# Altium project STM32F4Trunk.PrjPcb
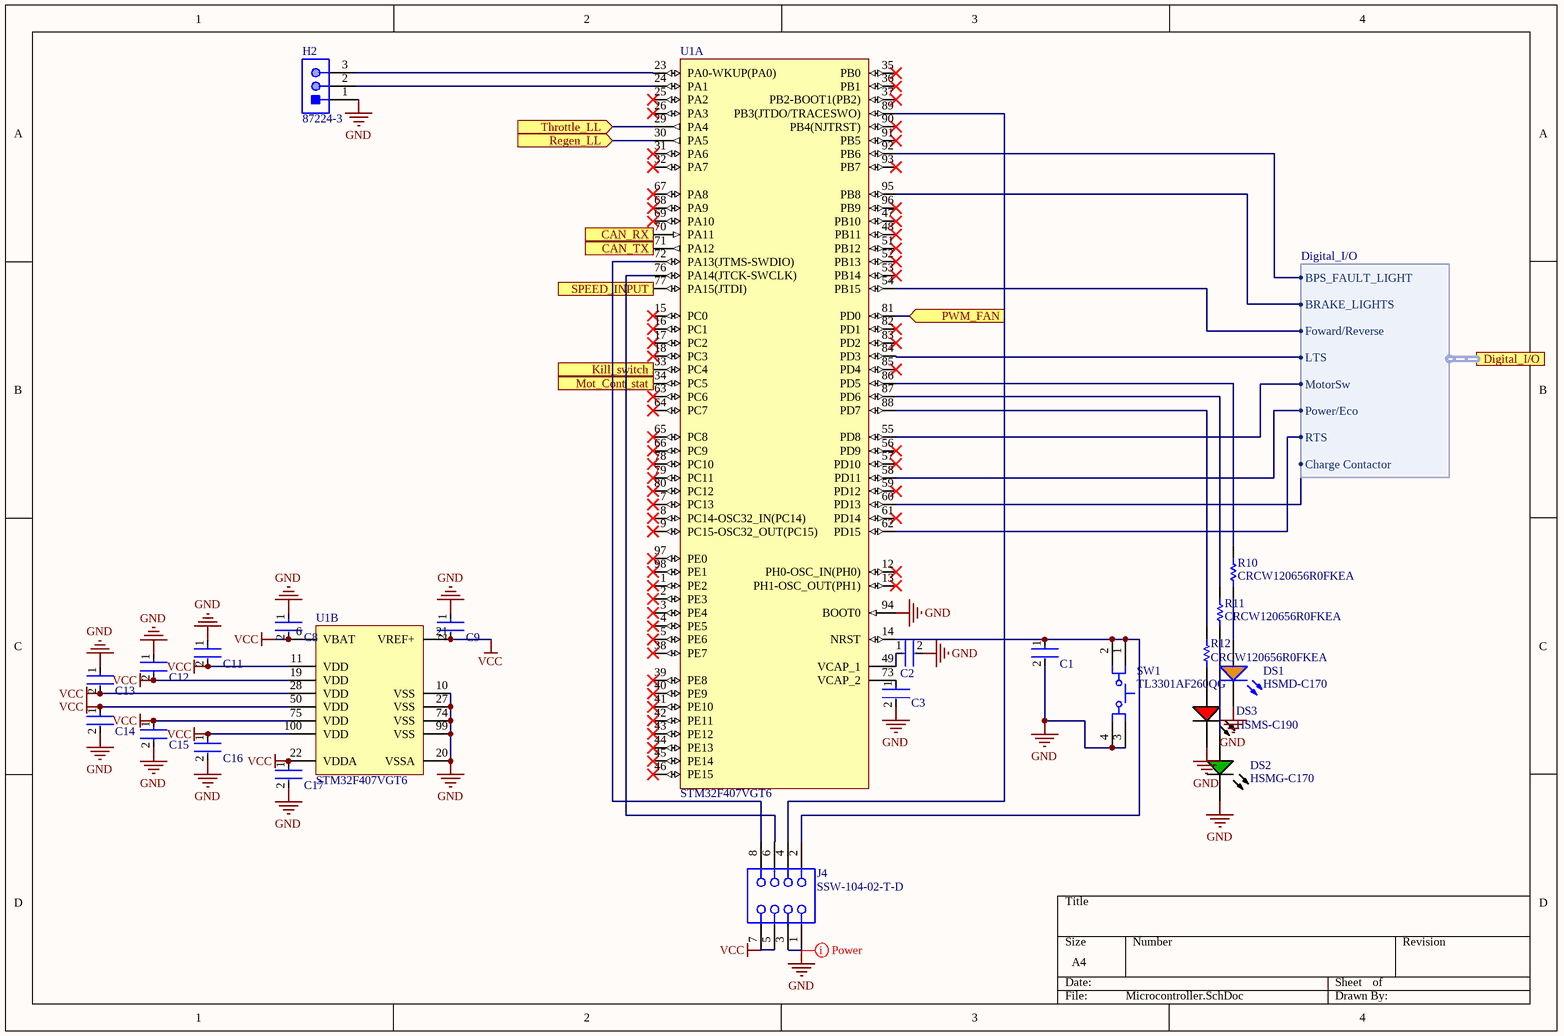
[diagram p0: Microcontroller.SchDoc]
5 sheets, 65 parts. Net scope: global (net labels, ports and power ports of the same name join across sheets).
Board file: PCB1.PcbDoc
Sheets:
  Microcontroller.SchDoc
  PowerSupply.SchDoc
  CAN.SchDoc
  ICs.SchDoc
  Connector.SchDoc

## Sheet Microcontroller.SchDoc
size A4

### Parts
C1  C0603C104K5RACTU  [Kemet_C0603_IPC_A]  (value not drawn)
C2  CC0805KKX7R6BB225  (value not drawn)
C3  CC0805KKX7R6BB225  (value not drawn)
C8  C0603C104K5RACTU  [Kemet_C0603_IPC_A]  (value not drawn)
C9  C0603C104K5RACTU  [Kemet_C0603_IPC_A]  (value not drawn)
C11  C0603C104K5RACTU  [Kemet_C0603_IPC_A]  (value not drawn)
C12  C0603C104K5RACTU  [Kemet_C0603_IPC_A]  (value not drawn)
C13  C0603C104K5RACTU  [Kemet_C0603_IPC_A]  (value not drawn)
C14  C0603C104K5RACTU  [Kemet_C0603_IPC_A]  (value not drawn)
C15  C0603C104K5RACTU  [Kemet_C0603_IPC_A]  (value not drawn)
C16  C0603C104K5RACTU  [Kemet_C0603_IPC_A]  (value not drawn)
C17  C0603C104K5RACTU  [Kemet_C0603_IPC_A]  (value not drawn)
DS1  HSMD-C170  [AVAG-HSMX-C170_V]
DS2  HSMG-C170  [AVAG-HSMX-C170_V]
DS3  HSMS-C190  [AVAG-HSMX-C190_V]
H2  87224-3  [TECO-87224-3_V]
J4  SSW-104-02-T-D  [SMTC-SSW-104-02-X-D]
R10  CRCW120656R0FKEA  [RESC3216X60X45LL10T20]
R11  CRCW120656R0FKEA  [RESC3216X60X45LL10T20]
R12  CRCW120656R0FKEA  [RESC3216X60X45LL10T20]
SW1  TL3301AF260QG  [ESWI-TL3301AF260QG_V]
U1  STM32F407VGT6  [STM-LQFP100_M]  (parts A,B of 2)

### Ports
CAN_RX (in), CAN_TX (out), Digital_I/O (harness Digital_I/O), Kill_switch (out), Mot_Cont_stat (out), PWM_FAN (in), Regen_LL (in), SPEED_INPUT (out), Throttle_LL (in)

### Harnesses
Digital_I/O: BPS_FAULT_LIGHT, BRAKE_LIGHTS, Foward/Reverse, LTS, MotorSw, Power/Eco, RTS, Charge Contactor

### Nets
GND: C1.2 C2.2 C3.2 C8.1 C9.1 C11.1 C12.1 C13.1 C14.2 C15.2 C16.2 C17.2 DS1.2(K) DS2.2(K) DS3.2(K) H2.1 J4.1 J4.3 SW1.3 SW1.4 U1.10(VSS) U1.20(VSSA) U1.27(VSS) U1.74(VSS) U1.94(BOOT0) U1.99(VSS)
VCC: C8.2 C9.2 C11.2 C12.2 C13.2 C14.1 C15.1 C16.1 C17.1 J4.5 J4.7 U1.6(VBAT) U1.11(VDD) U1.19(VDD) U1.21(VREF+) U1.22(VDDA) U1.28(VDD) U1.50(VDD) U1.75(VDD) U1.100(VDD)
NetC1_1: C1.1 J4.2 SW1.1 SW1.2 U1.14(NRST)
NetC2_1: C2.1 U1.49(VCAP_1)
NetC3_1: C3.1 U1.73(VCAP_2)
NetDS1_1: DS1.1(A) R10.1
NetDS2_1: DS2.1(A) R11.1
NetDS3_1: DS3.1(A) R12.1
NetH2_2: H2.2 U1.24(PA1)
NetH2_3: H2.3 U1.23(PA0-WKUP(PA0))
NetJ2_B5: U1.34(PC5) ; port Mot_Cont_stat
NetJ2_B7: U1.77(PA15(JTDI)) ; port SPEED_INPUT
NetJ3_A1: U1.33(PC4) ; port Kill_switch
NetJ3_A3: U1.81(PD0) ; port PWM_FAN
NetJ4_4: J4.4 U1.89(PB3(JTDO/TRACESWO))
NetJ4_6: J4.6 U1.76(PA14(JTCK-SWCLK))
NetJ4_8: J4.8 U1.72(PA13(JTMS-SWDIO))
NetR7_1: U1.54(PB15) ; port Digital_I/O.Foward/Reverse
NetR8_1: U1.58(PD11) ; port Digital_I/O.Power/Eco
NetR9_1: U1.55(PD8) ; port Digital_I/O.MotorSw
NetR10_2: R10.2 U1.86(PD5)
NetR11_2: R11.2 U1.87(PD6)
NetR12_2: R12.2 U1.88(PD7)
NetU1_29: U1.29(PA4) ; port Throttle_LL
NetU1_30: U1.30(PA5) ; port Regen_LL
NetU1_60: U1.60(PD13) ; port Digital_I/O.Charge Contactor
NetU1_62: U1.62(PD15) ; port Digital_I/O.RTS
NetU1_70: U1.70(PA11) ; port CAN_RX
NetU1_71: U1.71(PA12) ; port CAN_TX
NetU1_84: U1.84(PD3) ; port Digital_I/O.LTS
NetU1_92: U1.92(PB6) ; port Digital_I/O.BPS_FAULT_LIGHT
NetU1_95: U1.95(PB8) ; port Digital_I/O.BRAKE_LIGHTS

Not connected (* = marked no-connect by the designer): U1 1(PE2)* 2(PE3)* 3(PE4)* 4(PE5)* 5(PE6)* 7(PC13)* 8(PC14-OSC32_IN(PC14))* 9(PC15-OSC32_OUT(PC15))* 12(PH0-OSC_IN(PH0))* 13(PH1-OSC_OUT(PH1))* 15(PC0)* 16(PC1)* 17(PC2)* 18(PC3)* 25(PA2)* 26(PA3)* 31(PA6)* 32(PA7)* 35(PB0)* 36(PB1)* 37(PB2-BOOT1(PB2))* 38(PE7)* 39(PE8)* 40(PE9)* 41(PE10)* 42(PE11)* 43(PE12)* 44(PE13)* 45(PE14)* 46(PE15)* 47(PB10)* 48(PB11)* 51(PB12)* 52(PB13)* 53(PB14)* 56(PD9)* 57(PD10)* 59(PD12)* 61(PD14)* 63(PC6)* 64(PC7)* 65(PC8)* 66(PC9)* 67(PA8)* 68(PA9)* 69(PA10)* 78(PC10)* 79(PC11)* 80(PC12)* 82(PD1)* 83(PD2)* 85(PD4)* 90(PB4(NJTRST))* 91(PB5)* 93(PB7)* 96(PB9)* 97(PE0)* 98(PE1)*

### Layout directives
net class Power: GND

### Library data of the parts
C2 C3 = CC0805KKX7R6BB225: 2.2UF
DS1 = CMP-2000-06421-1: LED Uni-Color Orange, 52 mW, 20 mA, -40 to 85 degC, 2-Pin SMD, RoHS, Tape and Reel; Manufacturer: Avago; Forward Current If Max: 20mA; External Length / Height: 2mm; Luminous Intensity: 8mcd; Lens Shape: Rectangular; Bulb Size: 1.25mmx1.4mm; External Width: 1.25mm; Wavelength Typ: 605nm; Dominant Wavelength: 604nm; PIV Max: 5V; Opto Mounting Orientation: Top; Viewing Angle: 170°; LED Type: Standard; Forward Voltage: 2.2V; SVHC: NoSVHC(19-Dec-2012); No. of Pins: 2; External Depth: 0.8mm; Power Dissipation Pd: 52mW; Storage Temperature Max: 85°C; Package Description: 2-Pin Surface Mount Device, Body 2 x 1.25 mm, Height 0.8 mm; MSL: MSL2A-4weeks; Operating Temperature Range: -30°Cto+85°C; Datasheet URL: http://docs.avagotech.com/docs/AV02-0551EN; Manufacturer URL: http://www.avagotech.com/; Operating Temperature Min: -30°C; Light Area Height: 1.25mm; Mounting Technology: SurfaceMount; Storage Temperature Min: -40°C; LED Mounting: SMD; Peak Wavelength: 605nm; Package / Case: SMD; Peak Forward Current: 20mA; Forward Voltage VF Max: 2.2V; Mounting Type: SMD; LED Colour: Orange; Forward Current If: 20mA; Operating Temperature Max: 85°C; Voltage Vf Typ: 2.2V; Package Reference: HSMX-C170; Datasheet Version: 03/2012; Opto Case Style: SMD; Luminous Intensity Typ: 8mcd
DS2 = CMP-2000-05062-1: Chip LED, Green, 2.2 V, -40 to 85 degC, 2-Pin SMD, Pb-Free, Tape and Reel; Manufacturer: Avago; No. of Pins: 2; Peak Wavelength: 570nm; SVHC: NoSVHC(16-Jun-2014); Dominant Wavelength: 572nm; Forward Current If: 20mA; Viewing Angle: 170deg; Lens Shape: Rectangular; PIV Max: 5V; External Width: 1.25mm; LED Type: Standard; External Depth: 0.8mm; Opto Mounting Orientation: Top; Luminous Intensity: 15mcd; Luminous Intensity Min: 4mcd; Forward Voltage VF Max: 2.6V; External Length / Height: 2mm; Bulb Size: 1.25mmx1.4mm; Light Area Height: 1mm; Voltage Vf Typ: 2.2V; Operating Temperature Max: 85degC; Datasheet Version: Oct-08; MSL: MSL2A-4weeks; Peak Forward Current: 20mA; Package Description: 2-Pin Surface Mount Device, Body 2 x 1.25 mm, Height 0.8 mm; Datasheet URL: https://datasheet.ciiva.com/29280/180495-da-01-en-chip-led-hsmg-c170-gelb-gruen-29280971.pdf; Storage Temperature Min: -40degC; LED Colour: Green; Wavelength Typ: 570nm; Mounting Type: SMD; Forward Current If Max: 20mA; Dominant Wavelength Typ: 572nm; LED Mounting: SMD; Operating Temperature Range: -30degCto+85degC; Operating Temperature Min: -30degC; Manufacturer URL: http://www.avagotech.com/; Packaging: CutTape; Luminous Intensity Typ: 15mcd; Package Reference: HSMX-C170; Storage Temperature Max: 85degC; Opto Case Style: SMD; Forward Voltage: 2.2V
DS3 = CMP-2000-06427-1: LED Uni-Color Red, 52 mW, 20 mA, -40 to 85 degC, 2-Pin SMD, RoHS, Tape and Reel; Manufacturer: Avago; Reverse Voltage: 5V; Viewing Angle: 170deg; High Brightness: No; Lens Type: ColorlessDiffused; DELETED: Compliant; Product Height (mm): 0.8mm; Dominant Wave Length: 626nm; Number of  Elements: 1; Chip Material: GaP; Lum Intensity: 10mcd; Product Length (mm): 1.6mm; Forward Voltage: 2.6V; Power Dissipation: 52W; Shape Type: Rectangular; Forward Current: 25mA; Peak Wavelength: 630nm; Test Current (It): 20mA; Main Category: ChipLED; Lens Dimensions: 1x0.8x0.5mm; Pin Count: 2; Package Reference: HSMX-C190; Mounting Technology: SurfaceMount; Mounting: SurfaceMount; Datasheet URL: http://docs.avagotech.com/docs/AV02-0551EN; Package Type: ChipLed; Operating Temperature Classification: Industrial; Datasheet Version: 03/2012; Operating Temp Range: -40Cto85C; Emitting Color: Red; Rad Hardened: No; Manufacturer URL: http://www.avagotech.com/; Luminous Intensity: 10mcd; Package Description: 2-Pin Surface Mount Device, Body 1.6 x 0.8 mm, Height 0.9 mm; Type: Uni-Color; Packaging: TapeandReel; Product Depth (mm): 0.8mm
H2 = CMP-2000-05697-1: Male Header, Pitch 2.54 mm, 1 x 3 Position, Height 10.744 mm, Tail Length 3.175 mm, -65 to 105 degC, RoHS, Bulk; Manufacturer: TE Connectivity; Catalog Drawings: SingleSquareStraightPost / SingleSquareStraightPostSide; Connector Type: Header,Unshrouded; Pitch: 0.100"(2.54mm); Mating Products: 147738-2-ND / -CONNRCPT3POSVERTSMDGOLD / 147723-2-ND / -CONNRCPT3POSVERT.100GOLD / 146763-5-ND / -CONNRCPT3POSSGLVERT.100T/H / A32904-ND / -CONNRECEPT3POS.100VERTGOLD / A26922-ND / -CONNHOUSING3POS.100LOCKING / A26415-ND / -CONNRECEPT3POS.100VERTAU / A26964-ND / -CONNHOUSING3POS.100SINGLE / A3012-ND / -CONNHOUSING3POS.100SINGLE; Number of Positions Loaded: All; Featured Product: AMPMODUConnectors; Dynamic Catalog: AMPMODUModIISeries; 3D Model: 87224-3.pdf; Other Names: 87224-3-ND / A26545; Number of Positions: 3; RoHS Information: 87224-3StatementofCompliance; Termination: Solder; Datasheet URL: http://www.te.com/commerce/DocumentDelivery/DDEController?Action=showdoc&DocId=Customer+Drawing%7F87224%7FL3%7Fpdf%7FEnglish%7FENG_CD_87224_L3.pdf%7F87224-3; Category: Connectors,Interconnects; Contact Mating Length: 0.318"(8.08mm); Standard Package: 520; Mounting Type: ThroughHole; Family: RectangularConnectors-Headers,MalePins; Number of Rows: 1; Series: AMPMODUModII; Contact Finish Thickness: 15µin(0.38µm); Datasheet Version: Rev. L3, 08/2015; Package Reference: 87224-3; Mounting Technology: ThroughHole; Manufacturer URL: http://www.te.com/; Contact Type: MalePin; Packaging: Bulk; Color: Black; Package Description: Male Header, Pitch 2.54 mm, 1 x 3 Position, Height 10.744 mm, Tail Length 3.175 mm; Contact Finish: Gold
J4 = CMP-1023-00342-1: SQ Post Socket, Through-hole, Vertical, -55 to 105 degC, 2.54mm Pitch, 8-Pin, Female, RoHS; Manufacturer: Samtec; Mounting Technology: Through-hole; ComponentLink3Description: Package Specification; ComponentLink3URL: http://www.samtec.com/documents/webfiles/cpdf/SSW-1XX-XX-XXX-X-XX-XXX-XX-MKT.pdf; Temperature Range: -55 to 105 degC; DatasheetVersion: F-214; PackageVersion: CA, 6/1987; ComponentLink1URL: http://www.samtec.com; RoHS: True; Pitch: 2.54 mm; ComponentLink2Description: Datasheet; ComponentLink2URL: http://www.samtec.com/documents/webfiles/pdf/SSW_TH.PDF; PackageDescription: Assembly, Socket Strip .016 X .031 Tail; PackageReference: SSW-104-02-X-D; ComponentLink1Description: Manufacturer URL; PartNumber: SSW-104-02-T-D; Orientation: Vertical
R10-R12 = CMP-2003-02285-1: Manufacturer: Vishay Dale; Part Number: CRCW120656R0FKEA
SW1 = CMP-2000-07249-1: Tactile Switch, SPST-NO, 50 mA, 12 V, -20 to 70 degC, 4-Pin SMD, RoHS, Tape and Reel; Manufacturer: E-Switch; Catalog Drawings: TL3301xFFootprint; Contact Rating @ Voltage: 0.05A@12VDC; Featured Product: TL3301SeriesTactSwitch; Mechanical Life: 100,000Cycles; Product Training Modules: SwitchBasics; Actuator Orientation: TopActuated; Switch Travel: 0.25mm; Other Names: EG2527DKR; 3D Model: TL3301AFyyyyG.stp; Illumination: Non-Illuminated; Switch Function: Off-Mom; Online Catalog: TL3301Series; Outline: 6.00mmx6.00mm; Package Version: Rev. D, 10/2014; Operating Force: 260gf; Actuator Material: Polyamide(PA),Nylon; Actuator Type: Standard; Actuator Height off PCB, from Pins: 5.00mm; Packaging: Digi-Reel®; Standard Package: 1; Datasheet URL: https://www.e-switch.com/system/asset/product_line/data_sheet/185/TL3301.pdf; Family: TactileSwitches; Mounting Technology: SurfaceMount; Illumination Type, Color: -; Manufacturer URL: http://www.e-switch.ch/en/; RoHS Information: TL3301SeriesRoHSCertofCompliance; Ingress Protection: -; Package URL: http://spec_sheets.e-switch.com/specs/P010513.pdf; Illumination Voltage (Nominal): -; Operating Temperature: -20°C~70°C; Series: TL3301; Termination Style: GullWing; Category: Switches; Mounting Type: SurfaceMount; Package Description: 4-Pin Surface Mount Device, Body 6 x 6 mm; Features: -; Circuit: SPST-NO; Package Reference: TL3301AF260QG; Datasheet Version: 12/2013
U1 = CMP-0243-00017-3: ARM Cortex-M4 32-bit MCU+FPU, 210 DMIPS, 1024 kB Flash, 192 kB Internal RAM, 82 I/Os, 100-pin LQFP, -40 to 85 degC, Tray; Manufacturer: STMicroelectronics; Supply Voltage(Vcc) min (V): 1.8; Supply Voltage(Vcc) max (V): 3.6; I/Os (High Current): 82; Operating Frequency(F) (Processor speed) (MHz): 168; D/A Converter: 2x12-bit; FLASH Size (Prog) (kB): 1024; Internal RAM Size (kB): 192; PackageDescription: 100-Pin Low Profile Quad Flat Package, 14 x 14 mm Body, 0.5 mm Pitch; ComponentLink3URL: http://www.st.com/st-web-ui/static/active/en/resource/technical/document/data_brief/DM00071938.pdf; PackageVersion: Rev. 1, 06/2013; PackageReference: LQFP100; PartNumber: STM32F407VGT6; ComponentLink1Description: Manufacturer URL; ComponentLink2URL: http://www.st.com/st-web-ui/static/active/en/resource/technical/document/datasheet/DM00037051.pdf; DatasheetVersion: Rev. 4; ComponentLink3Description: Package Specification; Core: ARM Cortex-M4; ComponentLink2Description: Datasheet; Mounting Technology: Surface Mount; ComponentLink1URL: http://www.st.com/web/en/home.html; Packing: Tray

## Sheet PowerSupply.SchDoc
size A4
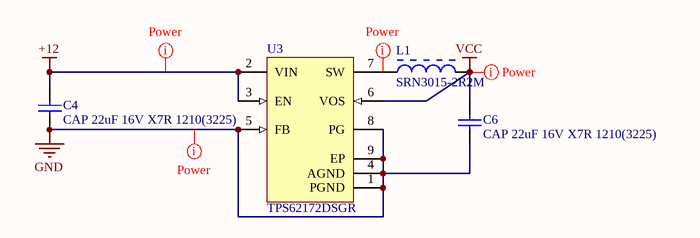
[diagram p1: PowerSupply.SchDoc]

### Parts
C4  CAP 22uF 16V X7R 1210(3225)  [CAPC1210(3225)280_L]
C6  CAP 22uF 16V X7R 1210(3225)  [CAPC1210(3225)280_L]
L1  SRN3015-2R2M  [BOUR-SRN3015-2_V]
U3  TPS62172DSGR  [DSG8-1600X900TP]

### Nets
+12: C4.2 U3.2(VIN) U3.3(EN)
GND: C4.1 C6.1 U3.1(PGND) U3.4(AGND) U3.5(FB) U3.8(PG) U3.9(EP)
VCC: C6.2 L1.2 U3.6(VOS)
NetL1_1: L1.1 U3.7(SW)

### Layout directives
net class Power: +12, GND, NetL1_1, VCC

### Library data of the parts
C4 C6 = CMP-1038-02277-1: CAP 22uF 16V ±10% 1210 (3225 Metric) Thickness 2.8mm SMD; Case-Metric: 3225; Case-EIA: 1210; Tolerance: Â±10%; Rated Voltage: 16 V; Technology: SMT; Value: 22uF; Max Thickness: 2.8 mm
L1 = CMP-0007-00003-1: Semi-shielded Power Inductor, 2.2 uH, +/- 20%, 1.8 A, -40 to 125 degC, 3 x 3 x 1.5 mm SMD, RoHS and Halogen Free, Tape and Reel; Manufacturer: Bourns; Isat: 1.65 A; Rated current: 1.8 A; Inductance: 2.2 uH; Inductance tolerance: +/- 20%; DCR Max: 0.072 Ohm; SRF Min: 90 MHz; Resistance to Solder Heat: +260 degC for 10 sec.; Operating Temperature: -40 to 125 degC; PartNumber: SRN3015-2R2M; Packing: Tape and Reel; ComponentLink3Description: Package Specification; ComponentLink2Description: Datasheet; RoHS: TRUE; ComponentLink3URL: http://www.bourns.com/data/global/pdfs/SRN3015.pdf; PackageDescription: 2-Pin SMD, Body 3 x 3 mm, Height 1.5 mm; ComponentLink1URL: http://www.bourns.com/; ComponentLink1Description: Manufacturer URL; DatasheetVersion: Aug-11; Mounting Technology: Surface Mount; ComponentLink2URL: http://www.bourns.com/data/global/pdfs/SRN3015.pdf; PackageReference: SRN3015
U3 = TPS62172DSGR: Buck Step Down Regulator with 3 to 17 V Input and 3.3 V Output, -40 to 85 degC, 8-Pin WSON (DSG), Green (RoHS & no Sb/Br); Manufacturer: Texas Instruments; Vout(Min)(V): 3.3; Vin(Min)(V): 3; Duty Cycle(Max)(%): 100; SubFamily: Step-Down Regulator; Iq(Typ)(mA): 0.017; Vin(Max)(V): 17; Synchronous Rectification: TRUE; Regulated Outputs(#): 1; Rating: Catalog; Switch Current Limit(Typ)(A): 1.05; Iout(Max)(A): 0.5; Vout(Max)(V): 3.3; Preset Vout(V): 3.3; Topology: Buck; Eco-Plan: Green (RoHS & no Sb/Br); PartNumber: TPS62172DSGR; ComponentLink1Description: Datasheet; ComponentLink2Description: Package Specification; DatasheetVersion: SLVSAT8A; ComponentLink3URL: Samples URL:http://www.ti.com/product/tps62172#samples; ComponentLink1URL: http://www.ti.com/general/docs/lit/getliterature.tsp?genericPartNumber=TPS62172&fileType=pdf; Code_JEDEC: MO-229; ComponentLink2URL: http://www.ti.com/litv/pdf/mpds308a; ComponentLink3Description: URL Link1; PackageVersion: revB, Oct-2010; Mounting Technology: Surface Mount; PackageReference: DSG8-1600X900TP; PackageDescription: 8-Pin Plastic Small Outline No-Lead, 2 x 2 x 0.8 mm Body, 0.5 mm Pitch, Exposed Pad

## Sheet CAN.SchDoc
size A4
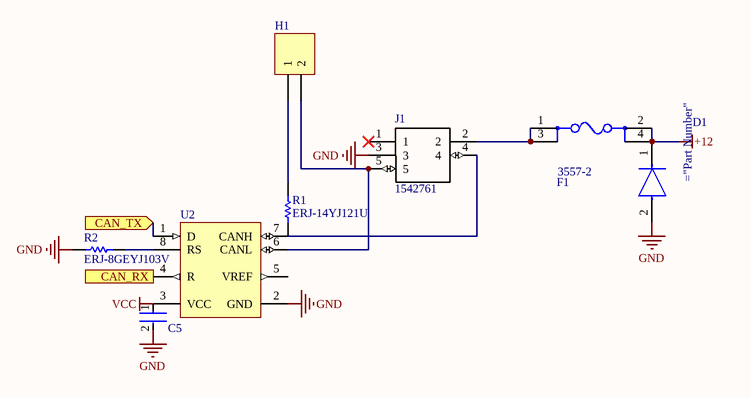
[diagram p2: CAN.SchDoc]

### Parts
C5  C0603C104K5RACTU  [Kemet_C0603_IPC_A]  (value not drawn)
D1  S1J-13-F  [Diodes_SMA_0]  (value not drawn)
F1  3557-2  [Keystone_3557-2_0]  (value not drawn)
H1  Header 0  [HDR1X2]  (value not drawn)
J1  1542761  [1542761]
R1  ERJ-14YJ121U  [RESC3225X70X50ML20T20]
R2  ERJ-8GEYJ103V  [RESC3216X70X50NL05T20]
U2  SN65HVD230D  [D0008A_M]  (value not drawn)

### Ports
CAN_RX (out), CAN_TX (in)

### Nets
+12: D1.1(C) F1.2 F1.4
GND: C5.2 D1.2(A) J1.3 R2.2 U2.2(GND)
VCC: C5.1 U2.3(VCC)
NetF1_1: F1.1 F1.3 J1.2
NetH1_1: H1.1 R1.2
NetH1_2: H1.2 J1.5 U2.6(CANL)
NetJ1_4: J1.4 R1.1 U2.7(CANH)
NetR2_1: R2.1 U2.8(RS)
NetU1_70: U2.4(R) ; port CAN_RX
NetU1_71: U2.1(D) ; port CAN_TX

Not connected (* = marked no-connect by the designer): J1 1*; U2 5(VREF)

### Library data of the parts
F1 = 3557-2: 3557-2 Automotive Fuse Holder Through Hole; Part Number: 3557-2
H1 = Header 2: Header, 2-Pin; LatestRevisionDate: 17-Jul-2002; LatestRevisionNote: Re-released for DXP Platform.; Publisher: Altium Limited
J1 = 1542761: Connector; Manufacturer_Name: Phoenix Contact; Allied_Number: 70170366; Datasheet Link: https://media.digikey.com/PDF/Data%20Sheets/Phoenix%20Contact%20PDFs/1542761.pdf; Height: 18mm; Manufacturer_Part_Number: 1542761; Mouser Part Number: 651-1542761; Mouser Price/Stock: https://www.mouser.com/Search/Refine.aspx?Keyword=651-1542761; RS Part Number: 8025583; RS Price/Stock: http://uk.rs-online.com/web/p/products/8025583; Allied Price/Stock: https://www.alliedelec.com/phoenixcontact-1542761/70170366/
R1 = CMP-2005-03490-1: 120Ohm; Manufacturer: Panasonic; Part Number: ERJ-14YJ121U
R2 = CMP-2003-00545-1: 10k; Manufacturer: Panasonic; Part Number: ERJ-8GEYJ103V
U2 = CMP-0315-00046-3: CAN Bus Transceiver, 3.3 V, -40 to 85 degC, 8-Pin SOIC (D), Green (RoHS & no Sb/Br), Tube; Supply Voltage Min: 3 V; Supply Voltage Max: 3.6 V; PartNumber: SN65HVD230D; ComponentLink2URL: http://www.ti.com/general/docs/lit/getliterature.tsp?genericGeneric Part Number=SN65HVD230&fileType=pdf; DatasheetVersion: SLOS346N; Generic Part Number: SN65HVD230; Packing: Tube; Temperature Min: -40 degC; Temperature Max: 85 degC; ComponentLink1Description: Manufacturer URL; Mounting Technology: Surface Mount; RoHS: TRUE; ComponentLink1URL: http://www.ti.com/; ComponentLink2Description: Datasheet; PackageDescription: 8-Pin Plastic Small Outline, Body 4.9 x 3.9 mm, Pitch 1.27 mm

## Sheet ICs.SchDoc
size OrCAD C
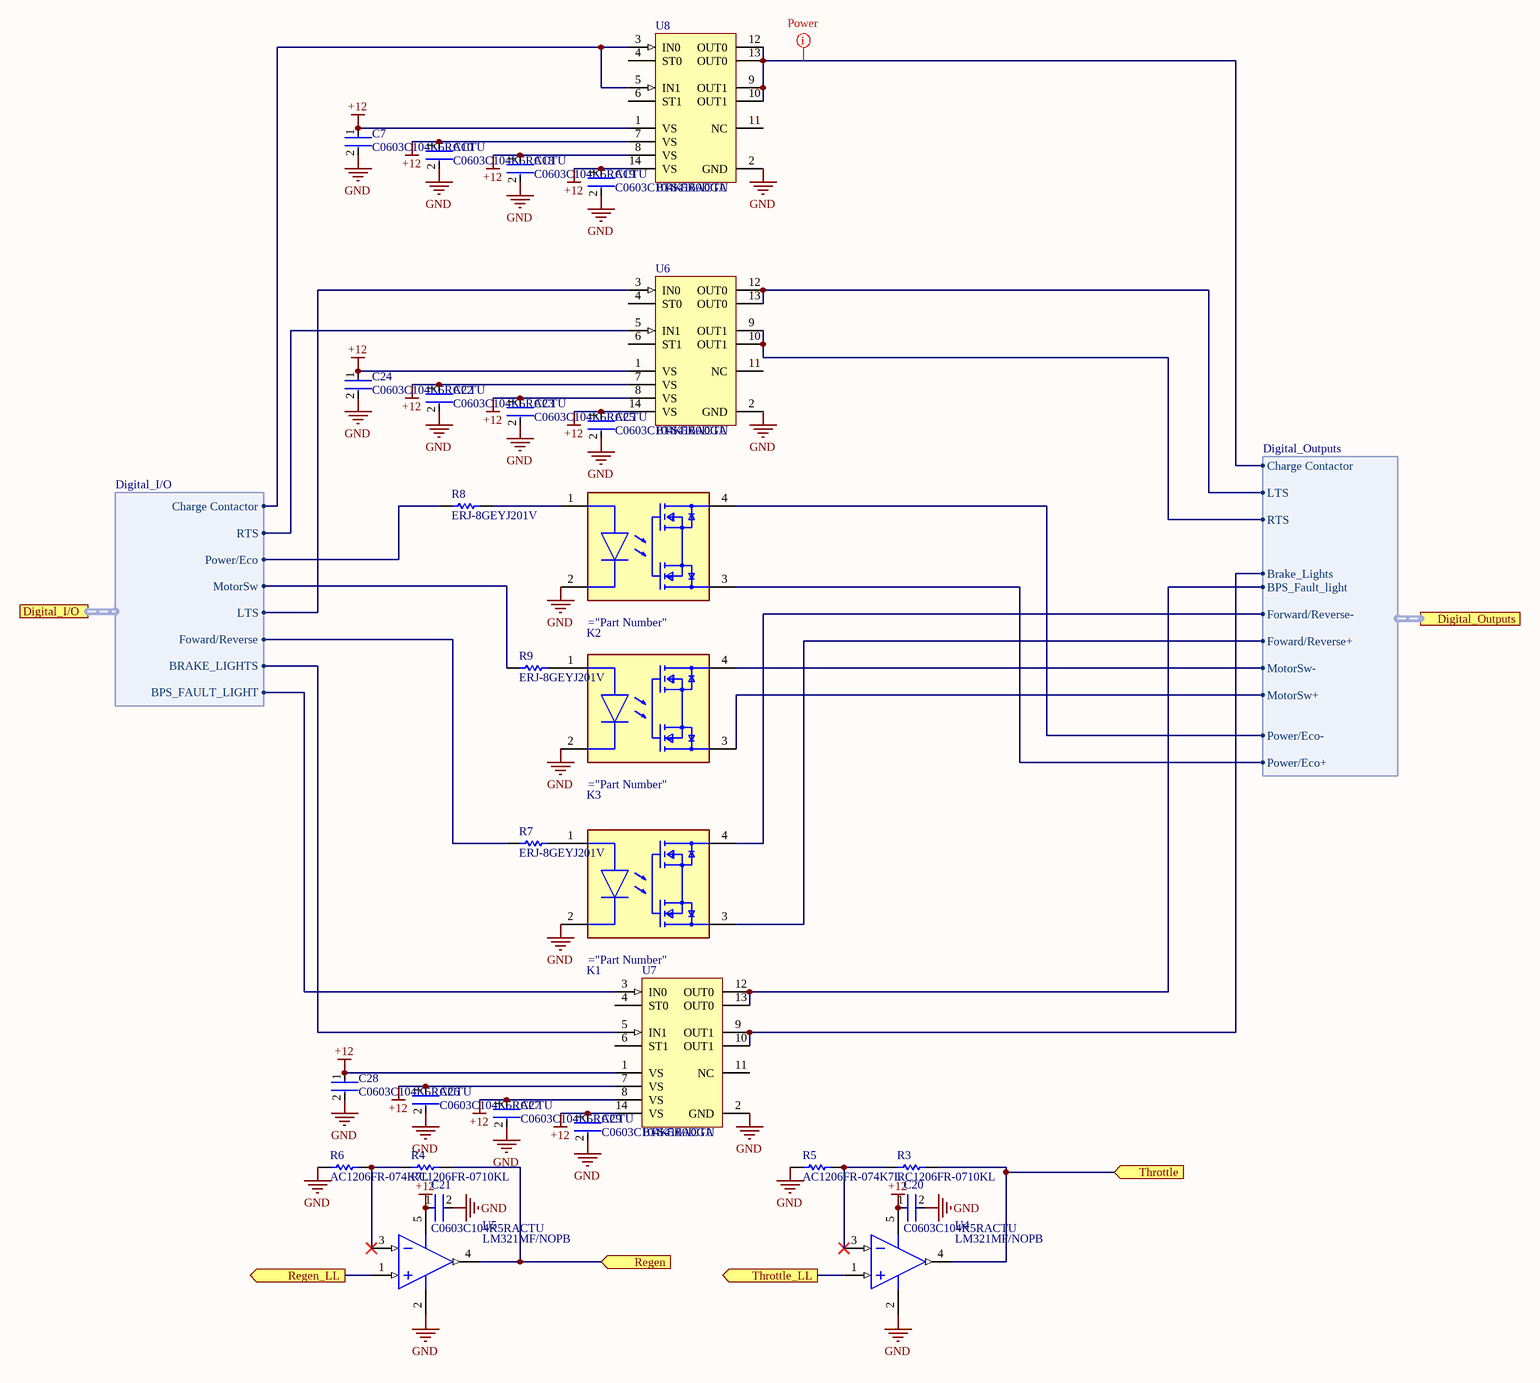
[diagram p3: ICs.SchDoc]

### Parts
C7  C0603C104K5RACTU  [Kemet_C0603_IPC_A]
C10  C0603C104K5RACTU  [Kemet_C0603_IPC_A]
C18  C0603C104K5RACTU  [Kemet_C0603_IPC_A]
C19  C0603C104K5RACTU  [Kemet_C0603_IPC_A]
C20  C0603C104K5RACTU  [Kemet_C0603_IPC_A]
C21  C0603C104K5RACTU  [Kemet_C0603_IPC_A]
C22  C0603C104K5RACTU  [Kemet_C0603_IPC_A]
C23  C0603C104K5RACTU  [Kemet_C0603_IPC_A]
C24  C0603C104K5RACTU  [Kemet_C0603_IPC_A]
C25  C0603C104K5RACTU  [Kemet_C0603_IPC_A]
C26  C0603C104K5RACTU  [Kemet_C0603_IPC_A]
C27  C0603C104K5RACTU  [Kemet_C0603_IPC_A]
C28  C0603C104K5RACTU  [Kemet_C0603_IPC_A]
C29  C0603C104K5RACTU  [Kemet_C0603_IPC_A]
K1  TLP3123_F  [Toshiba_11-5H1_0]  (value not drawn)
K2  TLP3123_F  [Toshiba_11-5H1_0]  (value not drawn)
K3  TLP3123_F  [Toshiba_11-5H1_0]  (value not drawn)
R3  RC1206FR-0710KL  [RESC3116X65X40ML10T20]
R4  RC1206FR-0710KL  [RESC3116X65X40ML10T20]
R5  AC1206FR-074K7L  [RESC3116X65X45NL10T20]
R6  AC1206FR-074K7L  [RESC3116X65X45NL10T20]
R7  ERJ-8GEYJ201V  [RESC3216X70X50LL05T20]
R8  ERJ-8GEYJ201V  [RESC3216X70X50LL05T20]
R9  ERJ-8GEYJ201V  [RESC3216X70X50LL05T20]
U4  LM321MF/NOPB  [DBV0005A_L]
U5  LM321MF/NOPB  [DBV0005A_L]
U6  BTS4160DGA  [INF-PG-DSO-14-37_N]
U7  BTS4160DGA  [INF-PG-DSO-14-37_N]
U8  BTS4160DGA  [INF-PG-DSO-14-37_N]

### Ports
Digital_I/O (harness Digital_I/O), Digital_Outputs (harness Digital_Outputs), Regen (in), Regen_LL (out), Throttle (in), Throttle_LL (out)

### Harnesses
Digital_I/O: BPS_FAULT_LIGHT, BRAKE_LIGHTS, Foward/Reverse, LTS, MotorSw, Power/Eco, RTS, Charge Contactor
Digital_Outputs: LTS, RTS, Power/Eco+, Power/Eco-, MotorSw+, MotorSw-, Foward/Reverse+, Forward/Reverse-, Brake_Lights, BPS_Fault_light, Charge Contactor

### Nets
+12: C7.1 C10.1 C18.1 C19.1 C20.1 C21.1 C22.1 C23.1 C24.1 C25.1 C26.1 C27.1 C28.1 C29.1 U4.5(V+) U5.5(V+) U6.1(VS) U6.7(VS) U6.8(VS) U6.14(VS) U7.1(VS) U7.7(VS) U7.8(VS) U7.14(VS) U8.1(VS) U8.7(VS) U8.8(VS) U8.14(VS)
GND: C7.2 C10.2 C18.2 C19.2 C20.2 C21.2 C22.2 C23.2 C24.2 C25.2 C26.2 C27.2 C28.2 C29.2 K1.2(C) K2.2(C) K3.2(C) R5.1 R6.1 U4.2(V-) U5.2(V-) U6.2(GND) U7.2(GND) U8.2(GND)
NetJ2_A3: U6.12(OUT0) U6.13(OUT0) ; port Digital_Outputs.LTS
NetJ2_A4: U6.9(OUT1) U6.10(OUT1) ; port Digital_Outputs.RTS
NetJ2_A5: U7.9(OUT1) U7.10(OUT1) ; port Digital_Outputs.Brake_Lights
NetJ2_A6: U8.9(OUT1) U8.10(OUT1) U8.12(OUT0) U8.13(OUT0) ; port Digital_Outputs.Charge Contactor
NetJ2_B1: R3.2 U4.4(OUT) ; port Throttle
NetJ2_B3: R4.2 U5.4(OUT) ; port Regen
NetJ3_A4: U7.12(OUT0) U7.13(OUT0) ; port Digital_Outputs.BPS_Fault_light
NetJ3_B1: K3.3(1_DRAIN) ; port Digital_Outputs.MotorSw+
NetJ3_B2: K3.4(2_DRAIN) ; port Digital_Outputs.MotorSw-
NetJ3_B3: K1.3(1_DRAIN) ; port Digital_Outputs.Foward/Reverse+
NetJ3_B4: K1.4(2_DRAIN) ; port Digital_Outputs.Forward/Reverse-
NetJ3_B5: K2.3(1_DRAIN) ; port Digital_Outputs.Power/Eco+
NetJ3_B6: K2.4(2_DRAIN) ; port Digital_Outputs.Power/Eco-
NetK1_1: K1.1(A) R7.2
NetK2_1: K2.1(A) R8.2
NetK3_1: K3.1(A) R9.2
NetR3_1: R3.1 R5.2 U4.3(IN-)
NetR4_1: R4.1 R6.2 U5.3(IN-)
NetR7_1: R7.1 ; port Digital_I/O.Foward/Reverse
NetR8_1: R8.1 ; port Digital_I/O.Power/Eco
NetR9_1: R9.1 ; port Digital_I/O.MotorSw
NetU1_29: U4.1(IN+) ; port Throttle_LL
NetU1_30: U5.1(IN+) ; port Regen_LL
NetU1_60: U8.3(IN0) U8.5(IN1) ; port Digital_I/O.Charge Contactor
NetU1_62: U6.5(IN1) ; port Digital_I/O.RTS
NetU1_84: U6.3(IN0) ; port Digital_I/O.LTS
NetU1_92: U7.3(IN0) ; port Digital_I/O.BPS_FAULT_LIGHT
NetU1_95: U7.5(IN1) ; port Digital_I/O.BRAKE_LIGHTS

Not connected (* = marked no-connect by the designer): U6 4(ST0) 6(ST1) 11(NC); U7 4(ST0) 6(ST1) 11(NC); U8 4(ST0) 6(ST1) 11(NC)

### Layout directives
net class Power: NetJ2_A6

### Library data of the parts
R3 R4 = CMP-2100-03676-1: Chip Resistor, 10 KOhm, +/- 1%, 0.25 W, -55 to 155 degC, 1206 (3216 Metric), RoHS, Tape and Reel; Manufacturer: Yageo; Voltage Rating: 200V; Resistance: 10KOhm; Temperature Coefficient: 100ppm/degreesC; Power Rating: 250mW; Packaging: TapeandReel; Termination: SMD/SMT; REACH SVHC: Unknown; Tolerance: 1%; Height: 0.55mm; Composition: ThickFilm; Max Operating Temperature: 155degC; Datasheet Version: Rev. 5, 10/2016; Lead Free: LeadFree; Case Code (Metric): 3216; Depth: 1.6mm; Package Quantity: 5000; RoHSCompliant: true; Military Standard: Not; Case/Package: 1206; Case Code (Imperial): 1206; Min Operating Temperature: -55degC; Datasheet URL: http://www.yageo.com/NewPortal/yageodocoutput?fileName=/pdf/R-Chip/PYu-RC_Group_51_RoHS_L_5.pdf; Length: 3.1mm; Manufacturer URL: http://www.yageo.com/; Package Reference: 1206.0; Width: 1.6mm; Package Description: 2-Pin Surface Mount Device, Body 3.1 x 1.6 mm
R5 R6 = CMP-2003-04896-1: Manufacturer: Yageo; Part Number: AC1206FR-074K7L
R7-R9 = CMP-2003-00580-1: Manufacturer: Panasonic; Part Number: ERJ-8GEYJ201V
U4 U5 = CMP-0055-01346-3: Low Power Single Op Amp, 5-pin SOT-23, Pb-Free; Manufacturer: Texas Instruments; PackageTopMarking: A63A*XTT; PowerWise: N; CompType: Amplifiers; ComponentLink1URL: http://www.ti.com/general/docs/lit/getliterature.tsp?genericPartNumber=LM321&fileType=pdf; PinCount: 5; RoHS: Y; ComponentLink1Description: Datasheet URL; PackageDescription: Molded SOT-23, .115 x .063 x .040 in Body, 5 Lead, .0375 in Pitch; Package Reference: DBV0005A
U6-U8 = BTS4160DGA: Smart High-Side Power Switch, 2 Channels, 1.7 A Load Current, -40 to 150 degC, PG-DSO-14-37, Reel, Green; Manufacturer: Infineon; Group: Automotive Qualified; RON(max) @ 150degreesC: 320 mOhm; Recommended Operating Voltage Min.: 5.5 V; Recommended Operating Voltage Max.: 20 V; Green: TRUE; toff (max): 270 us; Load Current (typ): 1.7 A; ton (max): 250 us; RON @ 25degreesC: 160 mOhm; Ptot (max): 1.4 W; Channels: 2; PartNumber: BTS4160DGA; ComponentLink1Description: Manufacturer URL; ComponentLink2Description: Datasheet; DatasheetVersion: Rev. 1.0; ComponentLink3URL: http://www.infineon.com/dgdl/BTS723GWDS11_2007_09_25.pdf?folderId=db3a304314dca389011537739e37155f&fileId=db3a304331c8f8560131dbfec21b0da9&sId=db3a30443d67b5ca013d854df2f133e5; ComponentLink1URL: http://www.infineon.com/; Packing: Reel; ComponentLink2URL: http://www.infineon.com/dgdl/BTS+4160DGA_DS2008_03_18_neu.pdf?folderId=db3a304314dca389011537739e37155f&fileId=db3a30431a5c32f2011a957ab5875685&sId=db3a30433d68e984013d7cba76cc57cb; ComponentLink3Description: Package Specification; PackageVersion: Sep-07; Halogen-free: TRUE; Mounting Technology: Surface Mount; PackageReference: PG-DSO-14-37; PackageDescription: 14-Pin Plastic (Green) Dual Small Outline Package, 8.65 x 3.9 mm Body, 1.27 mm Pitch

## Sheet Connector.SchDoc
size A4
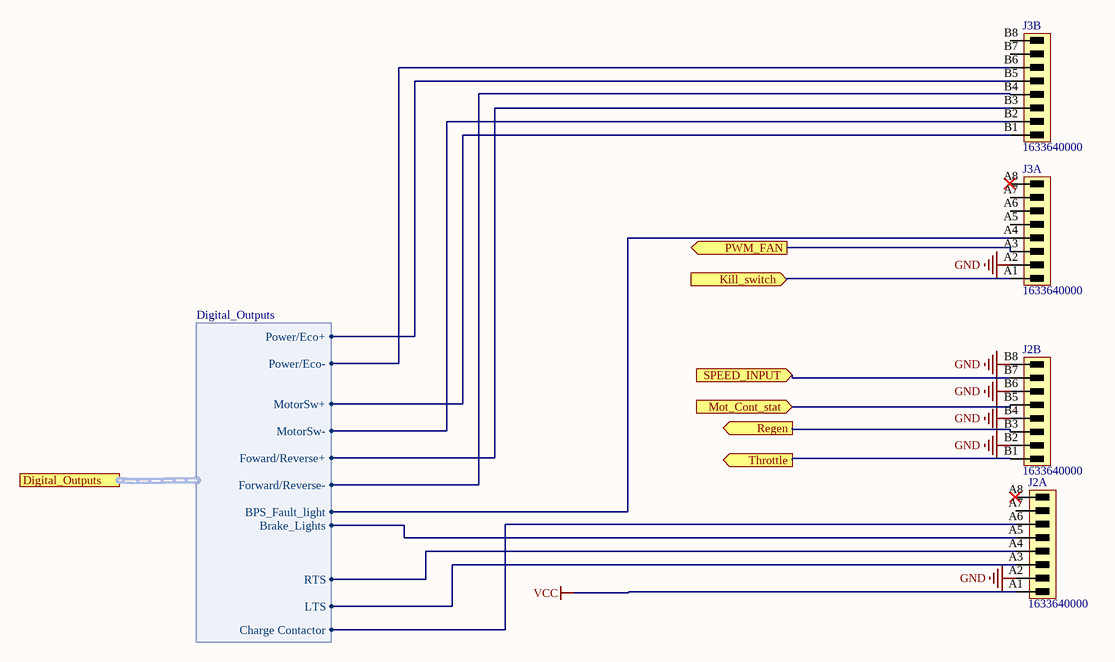
[diagram p4: Connector.SchDoc]

### Parts
J2  1633640000  [SLD_3_50_90G_16]  (parts A,B of 2)
J3  1633640000  [SLD_3_50_90G_16]  (parts A,B of 2)

### Ports
Digital_Outputs (harness Digital_Outputs), Kill_switch (in), Mot_Cont_stat (in), PWM_FAN (out), Regen (out), SPEED_INPUT (in), Throttle (out)

### Harnesses
Digital_Outputs: LTS, RTS, Power/Eco+, Power/Eco-, MotorSw+, MotorSw-, Foward/Reverse+, Forward/Reverse-, Brake_Lights, BPS_Fault_light, Charge Contactor

### Nets
GND: J2.A2 J2.B2 J2.B4 J2.B6 J2.B8 J3.A2
VCC: J2.A1
NetJ2_A3: J2.A3 ; port Digital_Outputs.LTS
NetJ2_A4: J2.A4 ; port Digital_Outputs.RTS
NetJ2_A5: J2.A5 ; port Digital_Outputs.Brake_Lights
NetJ2_A6: J2.A6 ; port Digital_Outputs.Charge Contactor
NetJ2_B1: J2.B1 ; port Throttle
NetJ2_B3: J2.B3 ; port Regen
NetJ2_B5: J2.B5 ; port Mot_Cont_stat
NetJ2_B7: J2.B7 ; port SPEED_INPUT
NetJ3_A1: J3.A1 ; port Kill_switch
NetJ3_A3: J3.A3 ; port PWM_FAN
NetJ3_A4: J3.A4 ; port Digital_Outputs.BPS_Fault_light
NetJ3_B1: J3.B1 ; port Digital_Outputs.MotorSw+
NetJ3_B2: J3.B2 ; port Digital_Outputs.MotorSw-
NetJ3_B3: J3.B3 ; port Digital_Outputs.Foward/Reverse+
NetJ3_B4: J3.B4 ; port Digital_Outputs.Forward/Reverse-
NetJ3_B5: J3.B5 ; port Digital_Outputs.Power/Eco+
NetJ3_B6: J3.B6 ; port Digital_Outputs.Power/Eco-

Not connected (* = marked no-connect by the designer): J2 A7 A8*; J3 A5 A6 A7 A8* B7 B8

### Library data of the parts
J2 J3 = CMP-1559-01473-1: OMNIMATE Signal - series BL/SL 3.50; Manufacturer: Weidmueller; Outgoing_elbow: 90°; Side_termination_characteristic: closed side; No_of_poles: 16; Mounting_onto_the_PCB: Solder connection; Contact_surface: tinned; Rated_voltage_for_surge_voltage_class_pollution_degree_II_2: 200 V; Rated_current_min_no_of_poles_TU_20_deg_C: 32 A; Insulating_material: PBT; Contact_material: CuSn; UL_94_flammability_rating: V-0; Pitch_inch: 0.138 inch; Short_text_for_material: SLD 3.50/16/90G 3.2SN OR BX; Pitch_mm: 3.5 mm; Rated_voltage_use_group_B_UL_1059: 300 V; Rated_current_use_group_B_UL_1059: 8 A; Solder_pin_length_mm: 3.2 mm; ComponentLink2URL: http://catalog.weidmueller.com/catalog/Start.do?localeId=en&ObjectID=1633640000; Colour: Orange; Revision: V1; PackageReference: SLD_3_50_90G_16; Packaging: Box; ComponentLink1Description: Manufacturer URL; ComponentLink2Description: URL Link1; ComponentLink1URL: http://www.weidmueller.com/; PartNumber: 1633640000; Qty: 20 PCS

## Nets that join several sheets
+12: PowerSupply (C4.2 U3.2 U3.3), CAN (D1.1 F1.2 F1.4), ICs (28 pins)
GND: Microcontroller (26 pins), PowerSupply (7 pins), CAN (5 pins), ICs (24 pins), Connector (6 pins)
VCC: Microcontroller (20 pins), PowerSupply (C6.2 L1.2 U3.6), CAN (C5.1 U2.3), Connector (J2.A1)
NetJ2_A3: ICs (U6.12 U6.13), Connector (J2.A3)
NetJ2_A4: ICs (U6.9 U6.10), Connector (J2.A4)
NetJ2_A5: ICs (U7.9 U7.10), Connector (J2.A5)
NetJ2_A6: ICs (U8.9 U8.10 U8.12 U8.13), Connector (J2.A6)
NetJ2_B1: ICs (R3.2 U4.4), Connector (J2.B1)
NetJ2_B3: ICs (R4.2 U5.4), Connector (J2.B3)
NetJ2_B5: Microcontroller (U1.34), Connector (J2.B5)
NetJ2_B7: Microcontroller (U1.77), Connector (J2.B7)
NetJ3_A1: Microcontroller (U1.33), Connector (J3.A1)
NetJ3_A3: Microcontroller (U1.81), Connector (J3.A3)
NetJ3_A4: ICs (U7.12 U7.13), Connector (J3.A4)
NetJ3_B1: ICs (K3.3), Connector (J3.B1)
NetJ3_B2: ICs (K3.4), Connector (J3.B2)
NetJ3_B3: ICs (K1.3), Connector (J3.B3)
NetJ3_B4: ICs (K1.4), Connector (J3.B4)
NetJ3_B5: ICs (K2.3), Connector (J3.B5)
NetJ3_B6: ICs (K2.4), Connector (J3.B6)
NetR7_1: Microcontroller (U1.54), ICs (R7.1)
NetR8_1: Microcontroller (U1.58), ICs (R8.1)
NetR9_1: Microcontroller (U1.55), ICs (R9.1)
NetU1_29: Microcontroller (U1.29), ICs (U4.1)
NetU1_30: Microcontroller (U1.30), ICs (U5.1)
NetU1_60: Microcontroller (U1.60), ICs (U8.3 U8.5)
NetU1_62: Microcontroller (U1.62), ICs (U6.5)
NetU1_70: Microcontroller (U1.70), CAN (U2.4)
NetU1_71: Microcontroller (U1.71), CAN (U2.1)
NetU1_84: Microcontroller (U1.84), ICs (U6.3)
NetU1_92: Microcontroller (U1.92), ICs (U7.3)
NetU1_95: Microcontroller (U1.95), ICs (U7.5)